# Altium project lab_1_samarin_usb_rs485.PrjPcb
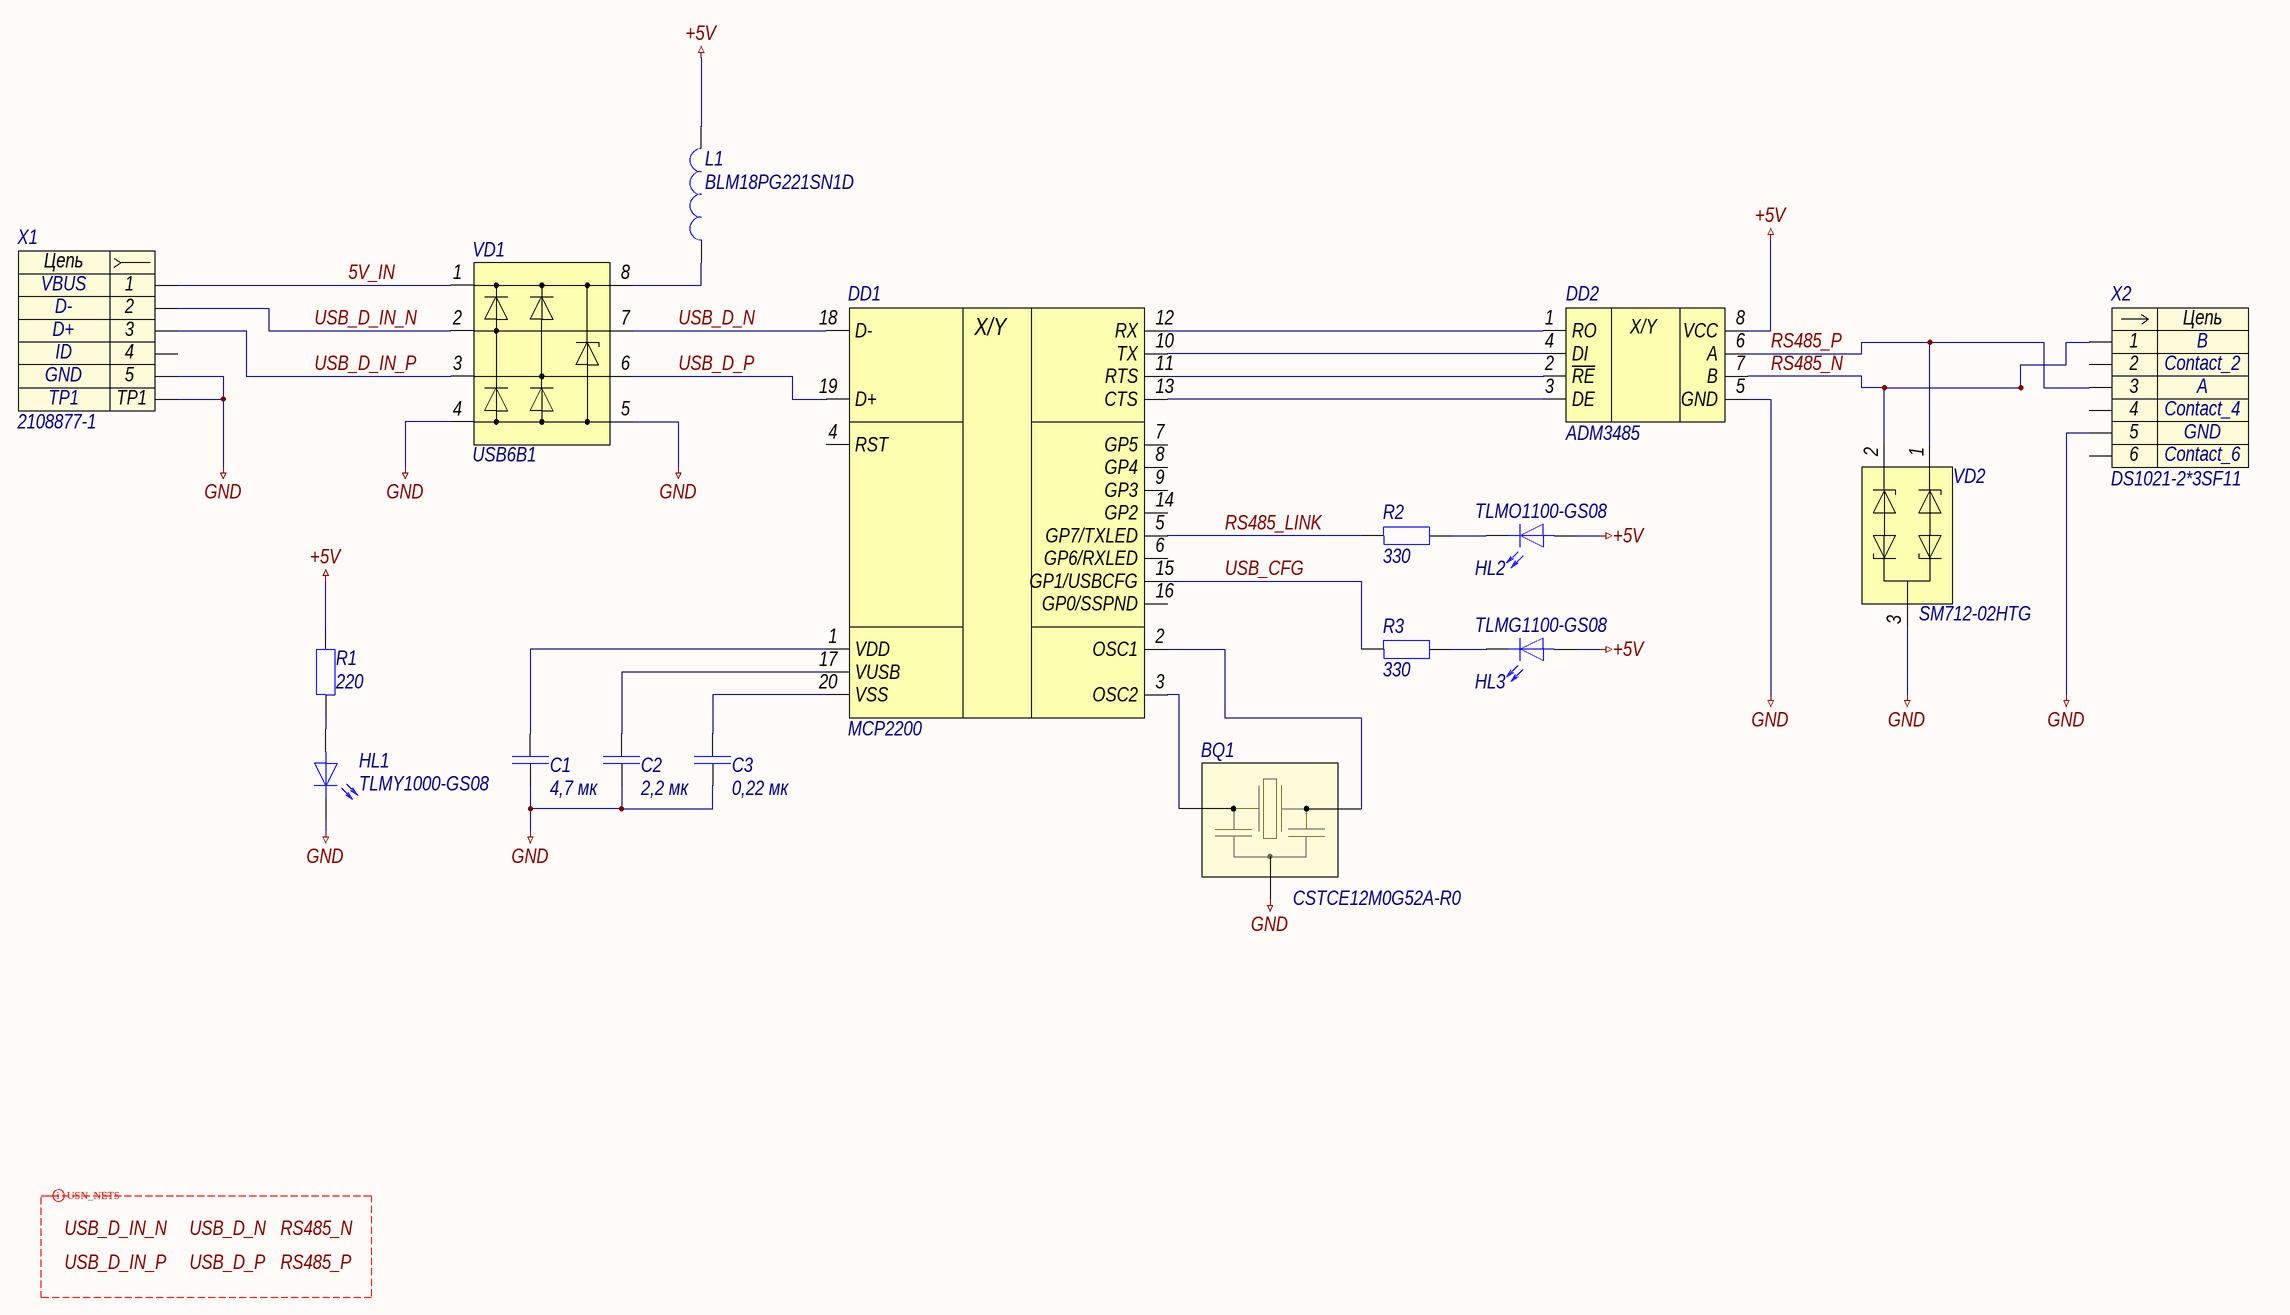
[diagram p0: lab_1_samarin_usb_rs485.SchDoc]
approver: Капустин; check: Капустин; designation: СПБПУ.331506.21; developer: Самарин; document_code: Ý3; document_type: Схема электрическая принципиальная; pcb_dec_number: СПБПУ.331506.21; project: Лабораторная работа 1; title: Преобразователь USB/RS485; title_line_1: Преобразователь; title_line_2: USB/RS485
1 sheet, 17 parts. Net scope: global (net labels, ports and power ports of the same name join across sheets).
Board file: lab_1_samarin_usb_rs485.PcbDoc

## Sheet lab_1_samarin_usb_rs485.SchDoc: Преобразователь USB/RS485
size 594 x 420 mm; ApprovedBy: Капустин; CheckedBy: Капустин; DrawnBy: Самарин; DocumentNumber: СПБПУ.331506.21Ý3; SheetNumber: n; DocumentCode: Ý3; ImagePath: СПБПУ.331506.21

### Parts
BQ1  CSTCE12M0G52A-R0  [CSTCE-3-320X130X40]
C1  4,7 мк  [C0603]
C2  2,2 мк  [C0603]
C3  0,22 мк  [C0603]
DD1  MCP2200  [SOIC-20]
DD2  ADM3485  [SOIC-8]
HL1  TLMY1000-GS08  [HL0603]
HL2  TLMO1100-GS08  [HL0603]
HL3  TLMG1100-GS08  [HL0603]
L1  BLM18PG221SN1D  [BLM-2-0603]
R1  220  [R0603]
R2  330  [R0603]
R3  330  [R0603]
VD1  USB6B1  [SO-8]
VD2  SM712-02HTG  [SOT23-3]
X1  2108877-1  [2108877-1]
X2  DS1021-2*3SF11  [DS1021-2X3SF11]

### Nets
+5V: DD2.8(VCC) HL2.2 HL3.2 L1.2 R1.2
GND: BQ1.2 C1.1 C2.1 C3.1 DD2.5(GND) HL1.1 VD1.4 VD1.5 VD2.3 X1.5 X1.TP1 X2.5
5V_IN: VD1.1 X1.1
RS485_LINK: DD1.5(GP7/TXLED) R2.1
RS485_N: DD2.7(B) VD2.2 X2.1
RS485_P: DD2.6(A) VD2.1 X2.3
USB_CFG: DD1.15(GP1/USBCFG) R3.1
USB_D_IN_N: VD1.2 X1.2
USB_D_IN_P: VD1.3 X1.3
USB_D_N: DD1.18(D-) VD1.7
USB_D_P: DD1.19(D+) VD1.6
NetBQ1_1: BQ1.1 DD1.2(OSC1)
NetBQ1_3: BQ1.3 DD1.3(OSC2)
NetC1_2: C1.2 DD1.1(VDD)
NetC2_2: C2.2 DD1.17(VUSB)
NetC3_2: C3.2 DD1.20(VSS)
NetDD1_10: DD1.10(TX) DD2.4(DI)
NetDD1_11: DD1.11(RTS) DD2.2(~{RE})
NetDD1_12: DD1.12(RX) DD2.1(RO)
NetDD1_13: DD1.13(CTS) DD2.3(DE)
NetHL1_2: HL1.2 R1.1
NetHL2_1: HL2.1 R2.2
NetHL3_1: HL3.1 R3.2
NetL1_1: L1.1 VD1.8

Not connected (* = marked no-connect by the designer): DD1 4(RST) 6(GP6/RXLED) 7(GP5) 8(GP4) 9(GP3) 14(GP2) 16(GP0/SSPND); X1 4; X2 2 4 6

### Layout directives
differential pair; rule Differential Pairs Routing [Pref Gap = 0.254mm    Min Gap  = 0.15mm    Max Gap  = 0.254mmPref Width = 0.381mm    Min Width  = 0.155mm    Max Width  = 0.381mm]; differential pair class USB_SIGNALS: RS485_N, RS485_P, USB_D_IN_N, USB_D_IN_P, USB_D_N, USB_D_P

### Notes on the sheet
- Labels drawn without touching a wire or pin: RS485_N, RS485_P, USB_D_IN_N, USB_D_IN_P, USB_D_N, USB_D_P
- Перв. примен.
- Справ. №
- Подп. и дата
- Инв. № дубл.
- Нормоконтроль:
- Взам. инв. №
- Изм.
- Лист
- № докум.
- Подп.
- Дата
- Лит.
- Масса
- Масштаб
- Т.контр.
- Пров.
- Разраб.
- Листов
- Разработал:
- Инв. № подл.
- Н.контр.
- Утв.
- Копировал
- Формат
- А2
- (in symbol dd0003) X/Y
- (in symbol dd0004) X/Y
- (in symbol x0001) Цепь
- (in symbol x0003) Цепь

### Library data of the parts
BQ1 = q0001: =Описание; ID: q0001; Фамилия: Самарин; Описание: Кварцевый резонатор 12 МГц; Производитель: Murata Manufacturing Co., Ltd.; Корпус: 3,2x1,3x0,4; Частота: 12 МГц; Наименование: CSTCE12M0G52A-R0; HelpURL: https://www.murata.com/en-us/products/productdetail?partno=CSTCE12M0G52A-R0
C1 = c0006: =Описание; ID: c0006; Фамилия: Ларионов; Описание: Конденсатор чип 0603 4,7 мкФ 25 В ±10 %; Наименование: CC0603KRX5R8BB475; Производитель: Yageo; Отклонение: ±10 %; Номинальное напряжение: 25 В; Рабочие температуры: от -55 °С до +85 °С; Корпус: 0603; Номинал: 4,7 мк; HelpURL: https://www.yageo.com/upload/media/product/productsearch/datasheet/mlcc/UPY-GPHC_X5R_4V-to-50V_26.pdf
C2 = c0005: =Описание; ID: c0005; Фамилия: Самарин; Описание: Конденсатор чип 0603 2,2 мкФ 50 В ±10 %; Наименование: CC0603KRX5R9BB225; Производитель: Yageo; Отклонение: ±10 %; Номинальное напряжение: 50 В; Рабочие температуры: от -55 °С до +85 °С; Корпус: 0603; Номинал: 2,2 мк; HelpURL: https://www.yageo.com/upload/media/product/productsearch/datasheet/mlcc/UPY-GPHC_X5R_4V-to-50V_26.pdf
C3 = c0003: =Описание; ID: c0003; Фамилия: Самарин; Описание: Конденсатор чип 0603 0,22 мкФ 50 В ±5 %; Наименование: CC0603JRX7R9BB224; Производитель: Yageo; Отклонение: ±5 %; Номинальное напряжение: 50 В; Рабочие температуры: от -55 °С до +125 °С; Корпус: 0603; Номинал: 0,22 мк; HelpURL: https://www.yageo.com/upload/media/product/products/datasheet/mlcc/UPY-GPHC_X7R_6.3V-to-50V_20.pdf
DD1 = dd0003: =Описание; ID: dd0003; Фамилия: Самарин; Описание: Преобразователь USB-UART; Производитель: Microchip Technology Inc.; Наименование: MCP2200; Корпус: SOIC-20; HelpURL: https://www.microchip.com/wwwproducts/en/en546923
DD2 = dd0004: =Описание; ID: dd0004; Фамилия: Самарин; Описание: Передатчик RS-485/RS-422; Производитель: Analog Devices, Inc.; Наименование: ADM3485; Корпус: SOIC-8; HelpURL: https://www.analog.com/ru/products/adm3485.html#product-samplebuy
HL1 = hl0003: =Описание; ID: hl0003; Фамилия: Ларионов; Описание: Светодиод чип 0603 желтый; Производитель: Vishay Intertechnology, Inc.; Цвет: Yellow; Номинальная сила света: 7,5 мкд; Номинальная длина волны: 588 нм; Номинальный прямой ток: 15 мА; Номинальное падение напряжение: 1,8 В; Рассеиваемая мощность: 40 мВт; Рабочие температуры: от -40 °С до +100 °С; Корпус: 0603; Наименование: TLMY1000-GS08; HelpURL: https://www.vishay.com/leds/list/product-83172/
HL2 = hl0004: =Описание; ID: hl0004; Фамилия: Ларионов; Описание: Светодиод чип 0603 оранжевый; Производитель: Vishay Intertechnology, Inc.; Цвет: Orange; Номинальная сила света: 80 мкд; Номинальная длина волны: 606 нм; Номинальный прямой ток: 30 мА; Номинальное падение напряжение: 2,1 В; Рассеиваемая мощность: 90 мВт; Рабочие температуры: от -40 °С до +100 °С; Корпус: 0603; Наименование: TLMO1100-GS08; HelpURL: https://www.vishay.com/leds/list/product-83173/
HL3 = hl0005: =Описание; ID: hl0005; Фамилия: Ларионов; Описание: Светодиод чип 0603 зеленый; Производитель: Vishay Intertechnology, Inc.; Цвет: Green; Номинальная сила света: 35 мкд; Номинальная длина волны: 570 нм; Номинальный прямой ток: 30 мА; Номинальное падение напряжение: 2,1 В; Рассеиваемая мощность: 90 мВт; Рабочие температуры: от -40 °С до +100 °С; Корпус: 0603; Наименование: TLMG1100-GS08; HelpURL: https://www.vishay.com/leds/list/product-83173/
L1 = l0002: =Описание; ID: l0002; Фамилия: Самарин; Описание: Ферритовая бусина 220 Ом ±25 %; Производитель: Murata Manufacturing Co., Ltd.; Сопротивление, 100 МГц: 220 Ом; Отклонение, 100 Мгц: ±25 %; Сопротивление при постоянном токе: 0,1 Ом; Рабочие температуры: от -55 °С до +125 °С; Корпус: 0603; Наименование: BLM18PG221SN1D; HelpURL: https://www.murata.com/en-global/products/productdetail?partno=BLM18PG221SN1%23
R1 = r0005: =Описание; ID: r0005; Фамилия: Ларионов; Описание: Резистор чип 0603 220 Ом ±1 % 0,1 Вт; Наименование: RC0603FR-07220RL; Производитель: Yageo; Отклонение: ±1 %; Номинальное напряжение: 75 В; Рабочие температуры: от -55 °С до +155 °С; Номинальный ток: 1 А; Корпус: 0603; Номинал: 220; HelpURL: https://www.yageo.com/upload/media/product/productsearch/datasheet/rchip/PYu-RC_Group_51_RoHS_L_11.pdf
R2 R3 = r0006: =Описание; ID: r0006; Фамилия: Ларионов; Описание: Резистор чип 0603 330 Ом ±1 % 0,1 Вт; Наименование: RC0603FR-07330RL; Производитель: Yageo; Отклонение: ±1 %; Номинальное напряжение: 75 В; Рабочие температуры: от -55 °С до +155 °С; Номинальный ток: 1 А; Корпус: 0603; Номинал: 330; HelpURL: https://www.yageo.com/upload/media/product/productsearch/datasheet/rchip/PYu-RC_Group_51_RoHS_L_11.pdf
VD1 = vd0005: =Описание; ID: vd0005; Фамилия: Ларионов; Описание: Диодная сборка для подавления помех, от 6 В; Производитель: STMicroelectronics; Наименование: USB6B1; Корпус: SO-8; HelpURL: https://www.st.com/content/st_com/en/products/protection-devices/esd-protection/usb-port-protection/usb6b1.html
VD2 = vd0003: =Описание; ID: vd0003; Фамилия: Самарин; Описание: Диодная сборка для подавления помех, -7/12 В; Производитель: Littelfuse, Inc.; Наименование: SM712-02HTG; Корпус: SOT23-3; HelpURL: https://www.littelfuse.com/products/tvs-diode-arrays/general-purpose-esd-protection/sm712.aspx
X1 = x0001: Contact_1: VBUS; Contact_2: D-; Contact_3: D+; Contact_4: ID; Contact_5: GND; ID: x0001; Фамилия: Ларионов; Описание: USB 2.0 Micro USB Type B IP68 гнездо прямой угол; Производитель: TE Connectivity; Наименование: 2108877-1; HelpURL: https://www.te.com/global-en/product-2108877-1.html
X2 = x0003: Contact_1: B; Contact_3: A; Contact_5: GND; ID: x0003; Фамилия: Самарин; Описание: PLS 3x2 pin 2,54 мм прямой; Производитель: Connfly Electronic Co. LTD; Contact_2: Contact_2; Contact_4: Contact_4; Contact_6: Contact_6; Наименование: DS1021-2*3SF11; HelpURL: http://www.connfly.com/productshow.aspx?id=118